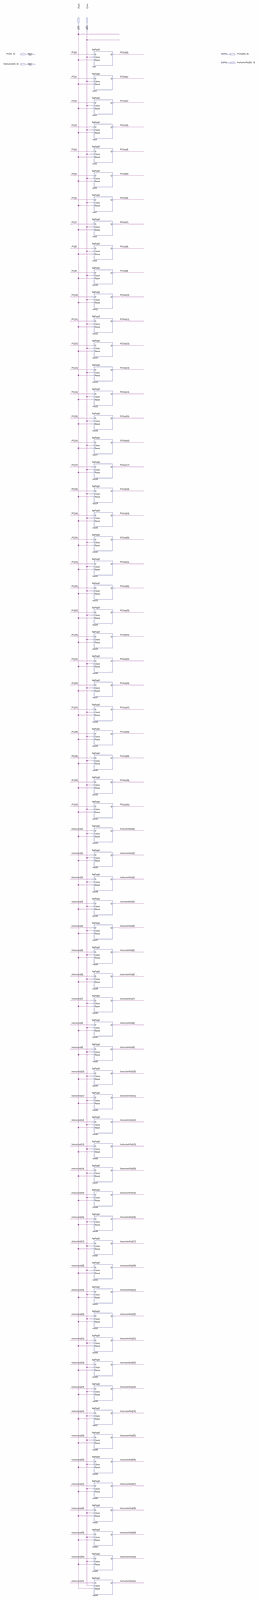
[diagram p0: schematic sheet, whole]
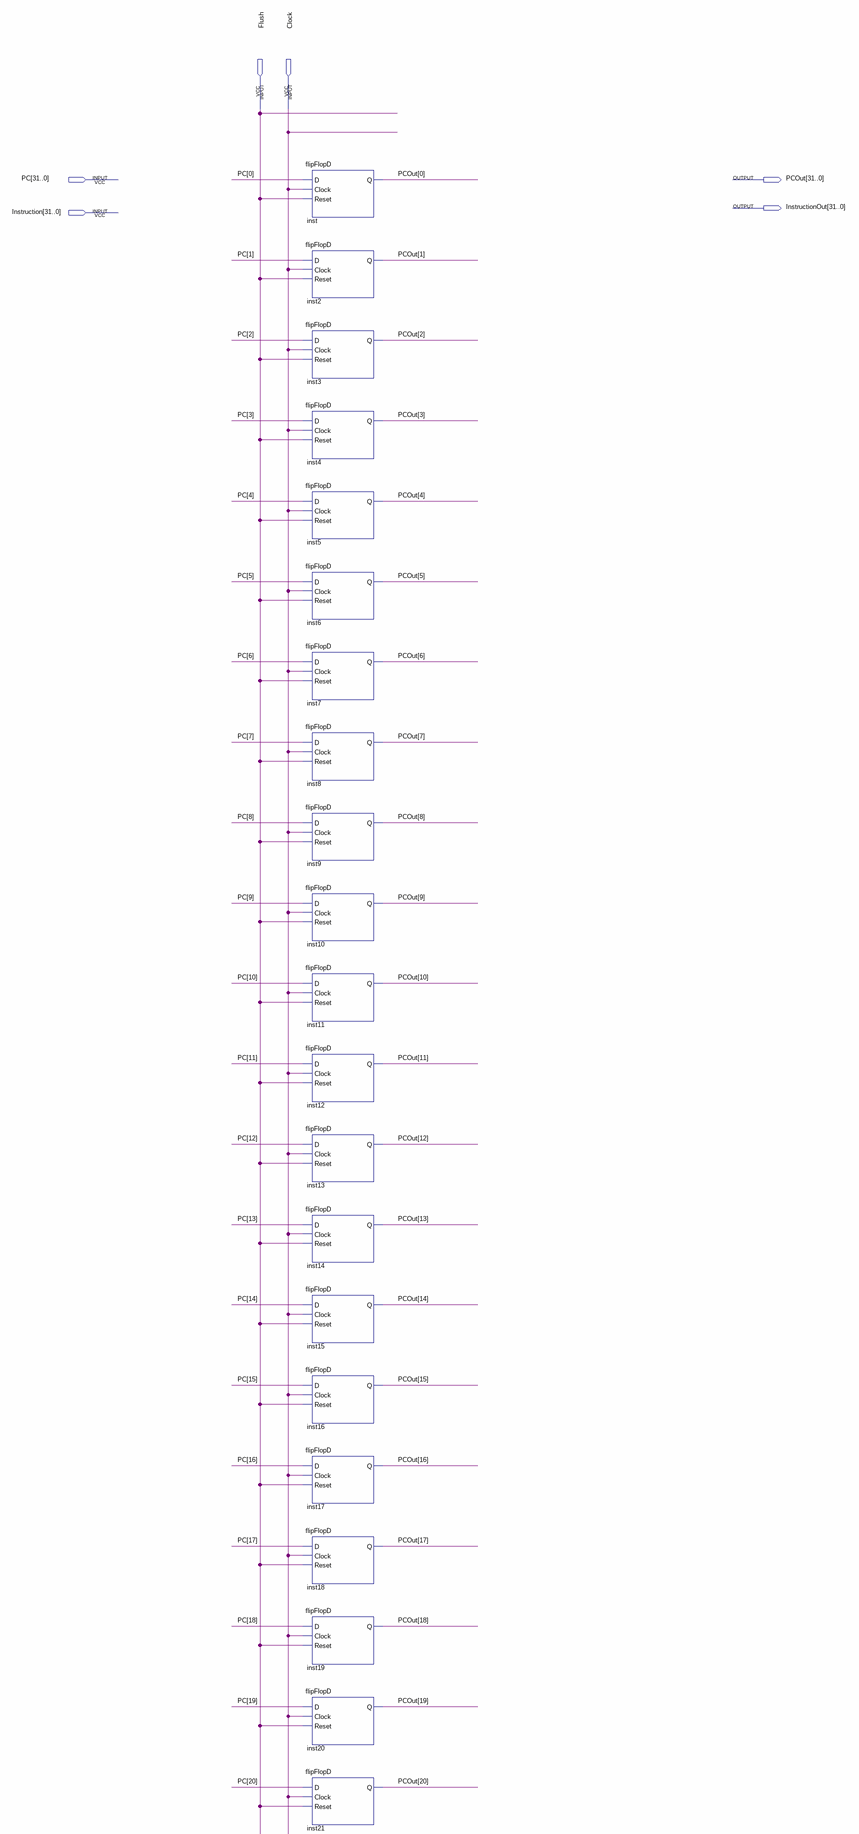
[diagram p1: schematic sheet, upper part]
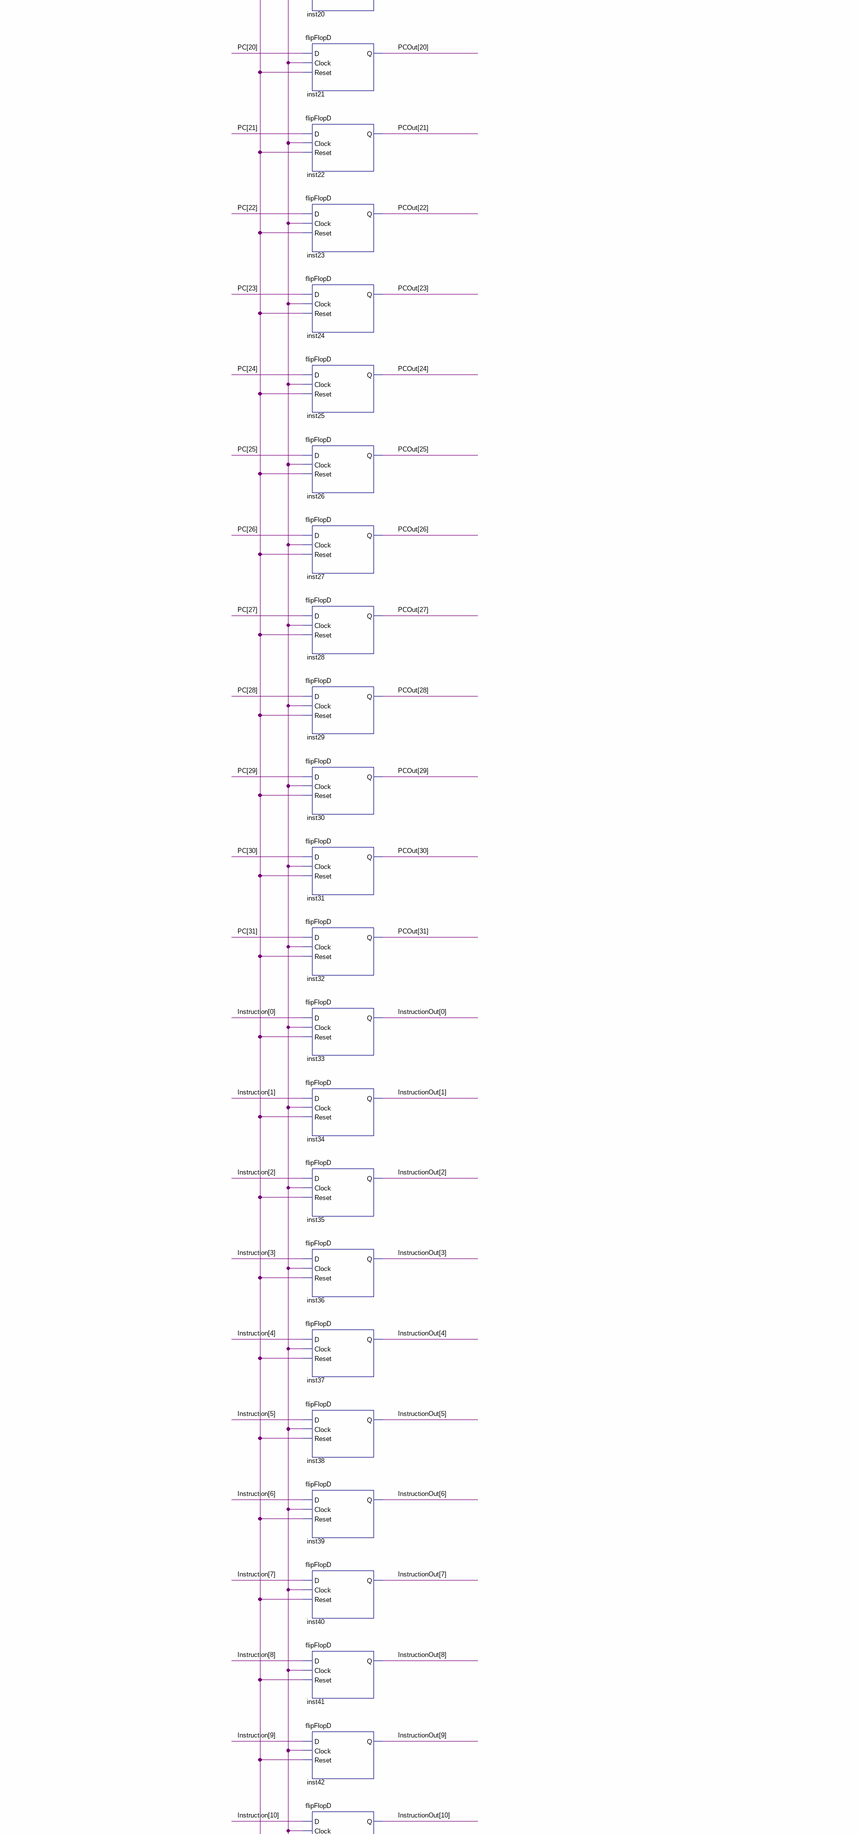
[diagram p2: schematic sheet, middle part]
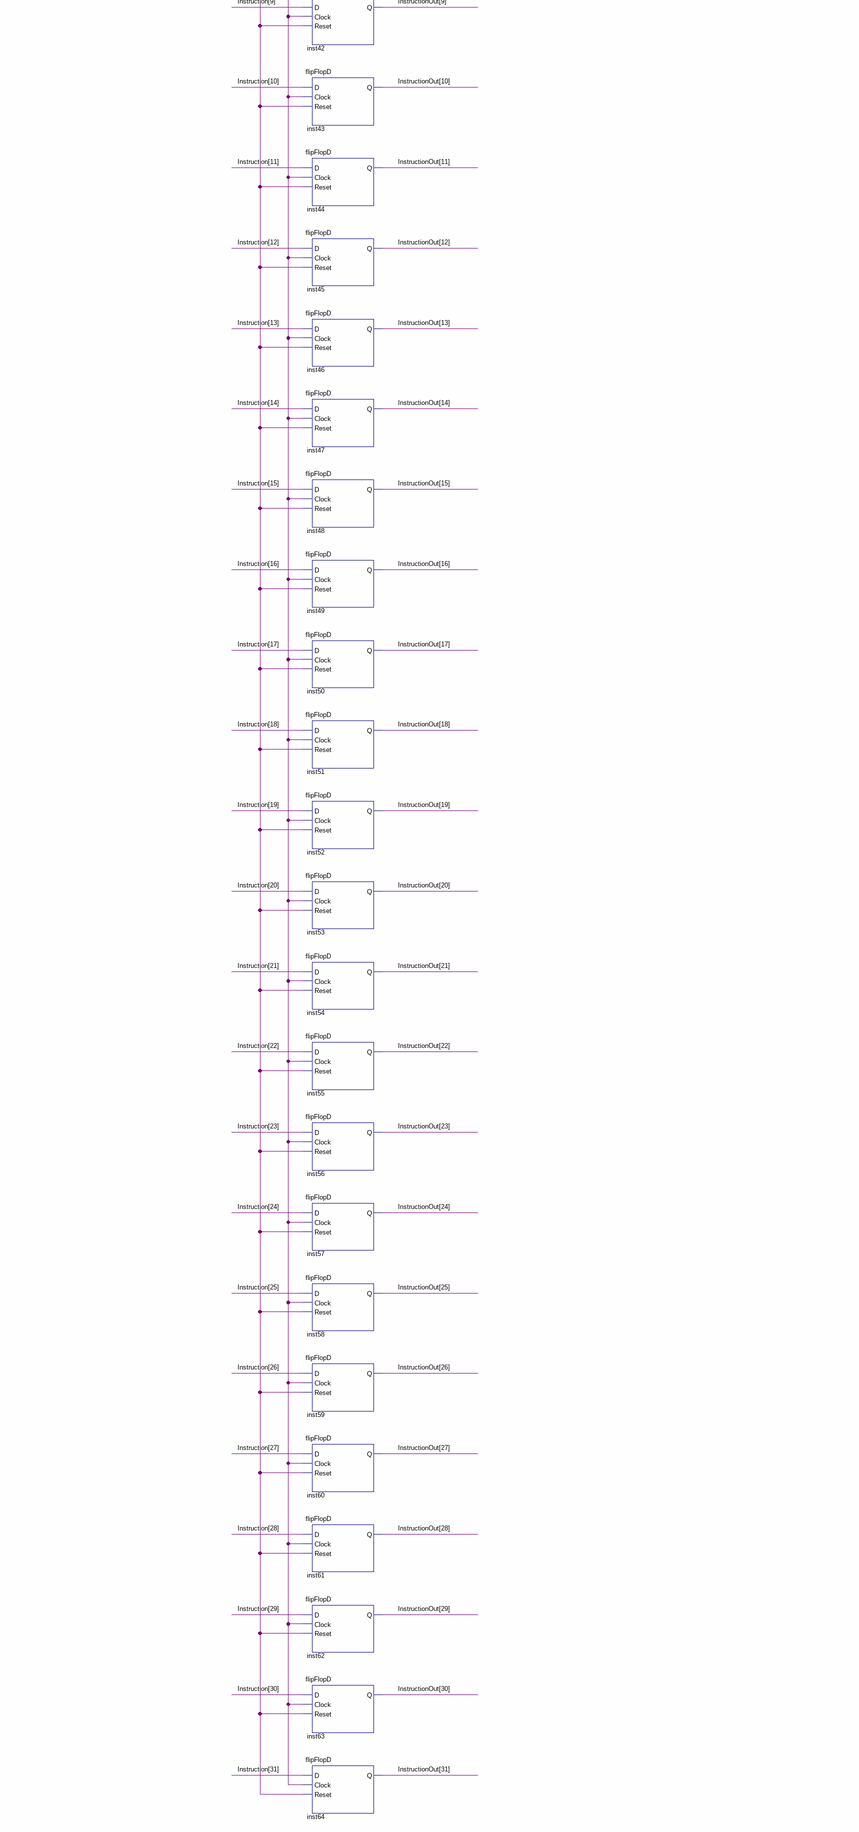
[diagram p3: schematic sheet, lower part]
// Quartus schematic IFID.bdf as structural Verilog: 64 symbols, 6 pins
module IFID (
  input  Flush,
  input  Clock,
  input  [31:0] PC,
  input  [31:0] Instruction,
  output [31:0] PCOut,
  output [31:0] InstructionOut
);

  flipFlopD inst (.D(PC[0]), .Clock(Clock), .Reset(Flush), .Q(PCOut[0]));
  flipFlopD inst2 (.D(PC[1]), .Clock(Clock), .Reset(Flush), .Q(PCOut[1]));
  flipFlopD inst3 (.D(PC[2]), .Clock(Clock), .Reset(Flush), .Q(PCOut[2]));
  flipFlopD inst4 (.D(PC[3]), .Clock(Clock), .Reset(Flush), .Q(PCOut[3]));
  flipFlopD inst5 (.D(PC[4]), .Clock(Clock), .Reset(Flush), .Q(PCOut[4]));
  flipFlopD inst6 (.D(PC[5]), .Clock(Clock), .Reset(Flush), .Q(PCOut[5]));
  flipFlopD inst7 (.D(PC[6]), .Clock(Clock), .Reset(Flush), .Q(PCOut[6]));
  flipFlopD inst8 (.D(PC[7]), .Clock(Clock), .Reset(Flush), .Q(PCOut[7]));
  flipFlopD inst9 (.D(PC[8]), .Clock(Clock), .Reset(Flush), .Q(PCOut[8]));
  flipFlopD inst10 (.D(PC[9]), .Clock(Clock), .Reset(Flush), .Q(PCOut[9]));
  flipFlopD inst11 (.D(PC[10]), .Clock(Clock), .Reset(Flush), .Q(PCOut[10]));
  flipFlopD inst12 (.D(PC[11]), .Clock(Clock), .Reset(Flush), .Q(PCOut[11]));
  flipFlopD inst13 (.D(PC[12]), .Clock(Clock), .Reset(Flush), .Q(PCOut[12]));
  flipFlopD inst14 (.D(PC[13]), .Clock(Clock), .Reset(Flush), .Q(PCOut[13]));
  flipFlopD inst15 (.D(PC[14]), .Clock(Clock), .Reset(Flush), .Q(PCOut[14]));
  flipFlopD inst16 (.D(PC[15]), .Clock(Clock), .Reset(Flush), .Q(PCOut[15]));
  flipFlopD inst17 (.D(PC[16]), .Clock(Clock), .Reset(Flush), .Q(PCOut[16]));
  flipFlopD inst18 (.D(PC[17]), .Clock(Clock), .Reset(Flush), .Q(PCOut[17]));
  flipFlopD inst19 (.D(PC[18]), .Clock(Clock), .Reset(Flush), .Q(PCOut[18]));
  flipFlopD inst20 (.D(PC[19]), .Clock(Clock), .Reset(Flush), .Q(PCOut[19]));
  flipFlopD inst21 (.D(PC[20]), .Clock(Clock), .Reset(Flush), .Q(PCOut[20]));
  flipFlopD inst22 (.D(PC[21]), .Clock(Clock), .Reset(Flush), .Q(PCOut[21]));
  flipFlopD inst23 (.D(PC[22]), .Clock(Clock), .Reset(Flush), .Q(PCOut[22]));
  flipFlopD inst24 (.D(PC[23]), .Clock(Clock), .Reset(Flush), .Q(PCOut[23]));
  flipFlopD inst25 (.D(PC[24]), .Clock(Clock), .Reset(Flush), .Q(PCOut[24]));
  flipFlopD inst26 (.D(PC[25]), .Clock(Clock), .Reset(Flush), .Q(PCOut[25]));
  flipFlopD inst27 (.D(PC[26]), .Clock(Clock), .Reset(Flush), .Q(PCOut[26]));
  flipFlopD inst28 (.D(PC[27]), .Clock(Clock), .Reset(Flush), .Q(PCOut[27]));
  flipFlopD inst29 (.D(PC[28]), .Clock(Clock), .Reset(Flush), .Q(PCOut[28]));
  flipFlopD inst30 (.D(PC[29]), .Clock(Clock), .Reset(Flush), .Q(PCOut[29]));
  flipFlopD inst31 (.D(PC[30]), .Clock(Clock), .Reset(Flush), .Q(PCOut[30]));
  flipFlopD inst32 (.D(PC[31]), .Clock(Clock), .Reset(Flush), .Q(PCOut[31]));
  flipFlopD inst33 (.D(Instruction[0]), .Clock(Clock), .Reset(Flush), .Q(InstructionOut[0]));
  flipFlopD inst34 (.D(Instruction[1]), .Clock(Clock), .Reset(Flush), .Q(InstructionOut[1]));
  flipFlopD inst35 (.D(Instruction[2]), .Clock(Clock), .Reset(Flush), .Q(InstructionOut[2]));
  flipFlopD inst36 (.D(Instruction[3]), .Clock(Clock), .Reset(Flush), .Q(InstructionOut[3]));
  flipFlopD inst37 (.D(Instruction[4]), .Clock(Clock), .Reset(Flush), .Q(InstructionOut[4]));
  flipFlopD inst38 (.D(Instruction[5]), .Clock(Clock), .Reset(Flush), .Q(InstructionOut[5]));
  flipFlopD inst39 (.D(Instruction[6]), .Clock(Clock), .Reset(Flush), .Q(InstructionOut[6]));
  flipFlopD inst40 (.D(Instruction[7]), .Clock(Clock), .Reset(Flush), .Q(InstructionOut[7]));
  flipFlopD inst41 (.D(Instruction[8]), .Clock(Clock), .Reset(Flush), .Q(InstructionOut[8]));
  flipFlopD inst42 (.D(Instruction[9]), .Clock(Clock), .Reset(Flush), .Q(InstructionOut[9]));
  flipFlopD inst43 (.D(Instruction[10]), .Clock(Clock), .Reset(Flush), .Q(InstructionOut[10]));
  flipFlopD inst44 (.D(Instruction[11]), .Clock(Clock), .Reset(Flush), .Q(InstructionOut[11]));
  flipFlopD inst45 (.D(Instruction[12]), .Clock(Clock), .Reset(Flush), .Q(InstructionOut[12]));
  flipFlopD inst46 (.D(Instruction[13]), .Clock(Clock), .Reset(Flush), .Q(InstructionOut[13]));
  flipFlopD inst47 (.D(Instruction[14]), .Clock(Clock), .Reset(Flush), .Q(InstructionOut[14]));
  flipFlopD inst48 (.D(Instruction[15]), .Clock(Clock), .Reset(Flush), .Q(InstructionOut[15]));
  flipFlopD inst49 (.D(Instruction[16]), .Clock(Clock), .Reset(Flush), .Q(InstructionOut[16]));
  flipFlopD inst50 (.D(Instruction[17]), .Clock(Clock), .Reset(Flush), .Q(InstructionOut[17]));
  flipFlopD inst51 (.D(Instruction[18]), .Clock(Clock), .Reset(Flush), .Q(InstructionOut[18]));
  flipFlopD inst52 (.D(Instruction[19]), .Clock(Clock), .Reset(Flush), .Q(InstructionOut[19]));
  flipFlopD inst53 (.D(Instruction[20]), .Clock(Clock), .Reset(Flush), .Q(InstructionOut[20]));
  flipFlopD inst54 (.D(Instruction[21]), .Clock(Clock), .Reset(Flush), .Q(InstructionOut[21]));
  flipFlopD inst55 (.D(Instruction[22]), .Clock(Clock), .Reset(Flush), .Q(InstructionOut[22]));
  flipFlopD inst56 (.D(Instruction[23]), .Clock(Clock), .Reset(Flush), .Q(InstructionOut[23]));
  flipFlopD inst57 (.D(Instruction[24]), .Clock(Clock), .Reset(Flush), .Q(InstructionOut[24]));
  flipFlopD inst58 (.D(Instruction[25]), .Clock(Clock), .Reset(Flush), .Q(InstructionOut[25]));
  flipFlopD inst59 (.D(Instruction[26]), .Clock(Clock), .Reset(Flush), .Q(InstructionOut[26]));
  flipFlopD inst60 (.D(Instruction[27]), .Clock(Clock), .Reset(Flush), .Q(InstructionOut[27]));
  flipFlopD inst61 (.D(Instruction[28]), .Clock(Clock), .Reset(Flush), .Q(InstructionOut[28]));
  flipFlopD inst62 (.D(Instruction[29]), .Clock(Clock), .Reset(Flush), .Q(InstructionOut[29]));
  flipFlopD inst63 (.D(Instruction[30]), .Clock(Clock), .Reset(Flush), .Q(InstructionOut[30]));
  flipFlopD inst64 (.D(Instruction[31]), .Clock(Clock), .Reset(Flush), .Q(InstructionOut[31]));
endmodule
